# EAGLE design ATX.Buttons.Board (EAGLE 6.6.0)
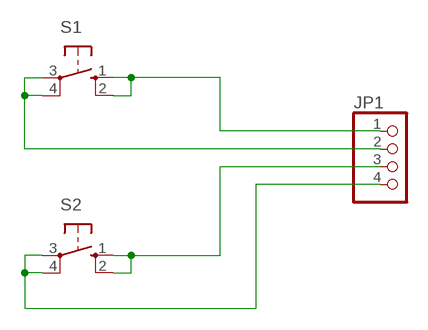
[diagram p0: schematic, sheet 1]

## Parts
JP1  PINHD-1X4/90  [1X04/90]
S1  10-XX  [B3F-10XX]
S2  10-XX  [B3F-10XX]

## Nets
N$1: JP1.1 S1.1(S) S1.2(S1)
N$2: JP1.3 S2.1(S) S2.2(S1)
N$3: JP1.4 S2.3(P) S2.4(P1)
N$4: JP1.2 S1.3(P) S1.4(P1)

## Library data of the parts
JP1 = pinhead:PINHD-1X4: PIN HEADER
S1 S2 = switch-omron:10-XX: OMRON SWITCH; MPN: B3F-1000; OC_FARNELL: 176432; OC_NEWARK: 36M3542

## Board
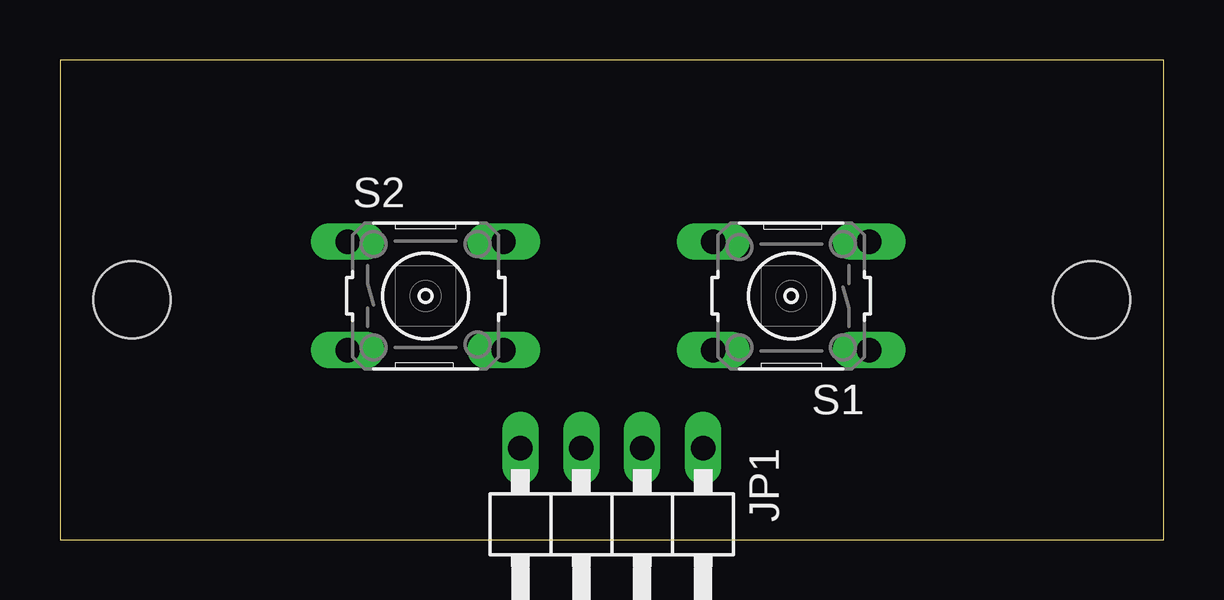
[diagram p1: board, top side]
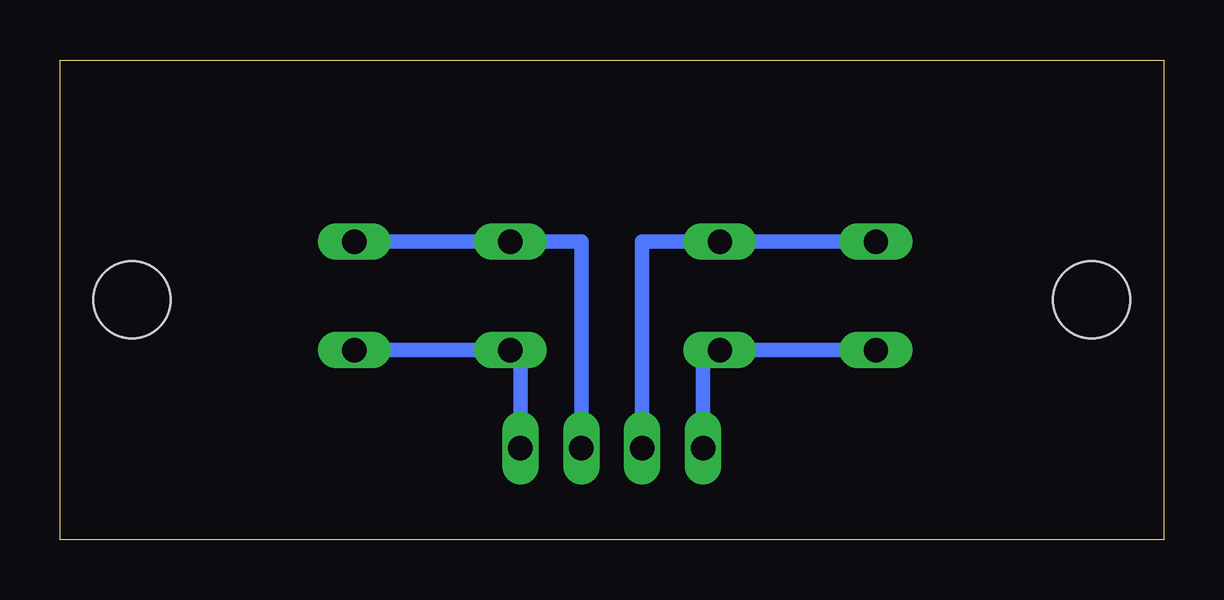
[diagram p2: board, bottom side, seen from below]

Size 46 x 20 mm. Coordinates in mm from the lower left corner, seen from the top.
Outline: 0,0 46,0 46,20 0,20 0,0
Copper layers (1*16): Top 0.035mm / dielectric 1.5mm / Bottom 0.035mm
Design rules "default": minimum track width 10mil, minimum drill 24mil, track to track 8mil, track to pad 8mil, pad to pad 8mil, via to via 8mil, smd to smd 8mil, copper to edge 40mil, drill to drill 8mil, minimum pad ring 10mil, minimum via ring 8mil, stop-mask expansion 4mil, vias tented up to drill 0mil, thermal gap 10mil
Holes 3.2 mm at 3,10 43,10

### Footprints (pad centres in the part's own frame; a part is rotated, then mirrored left to right if it is on the bottom)
1X04/90 = drill 1.016 long: 1 -3.81,-3.81; 2 -1.27,-3.81; 3 1.27,-3.81; 4 3.81,-3.81
B3F-10XX = drill 1.016 long: 1 -3.251,2.261; 2 3.251,2.261; 3 -3.251,-2.261; 4 3.251,-2.261

### Placement (x,y rotation side)
JP1  23,0 180 top
S1  30.48,10.16 180 top
S2  15.24,10.16 0 top

### Tracks (layer width: path | path; a pad name or v marks a point on that pad's centre or on a via)
N$1
  Bottom 0.61: JP1.1 26.81,7.9 S1.2 S1.1
N$2
  Bottom 0.61: JP1.3 21.73,12.42 S2.2 S2.1
N$3
  Bottom 0.61: S2.3 S2.4 19.19,7.9 JP1.4
N$4
  Bottom 0.61: JP1.2 24.27,12.42 S1.4 S1.3